# Altium schematic sheet CONNECTION.SchDoc
size A4; SheetNumber: 6; SheetTotal: 6
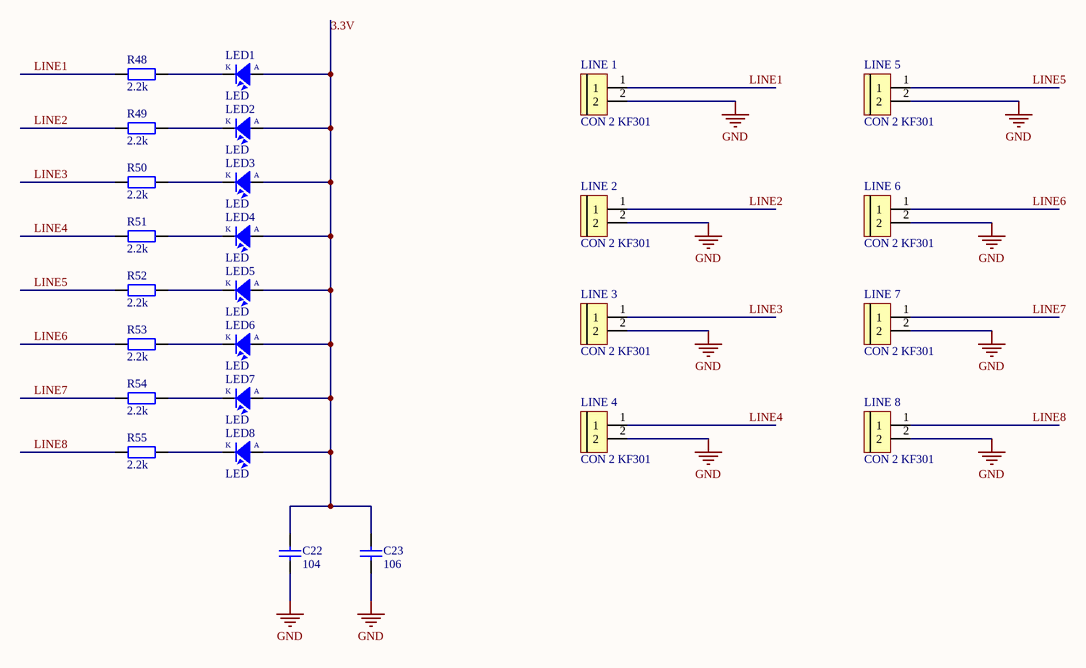
[diagram p0: CONNECTION.SchDoc]

## Parts
C22  104  [tu 0603]
C23  106  [tu 0603]
LED1  LED  [LED-0805]
LED2  LED  [LED-0805]
LED3  LED  [LED-0805]
LED4  LED  [LED-0805]
LED5  LED  [LED-0805]
LED6  LED  [LED-0805]
LED7  LED  [LED-0805]
LED8  LED  [LED-0805]
LINE_1  CON 2 KF301  [Con 2 KF301 5.08]
LINE_2  CON 2 KF301  [Con 2 KF301 5.08]
LINE_3  CON 2 KF301  [Con 2 KF301 5.08]
LINE_4  CON 2 KF301  [Con 2 KF301 5.08]
LINE_5  CON 2 KF301  [Con 2 KF301 5.08]
LINE_6  CON 2 KF301  [Con 2 KF301 5.08]
LINE_7  CON 2 KF301  [Con 2 KF301 5.08]
LINE_8  CON 2 KF301  [Con 2 KF301 5.08]
R48  2.2k  [tro smd 0805]
R49  2.2k  [tro smd 0805]
R50  2.2k  [tro smd 0805]
R51  2.2k  [tro smd 0805]
R52  2.2k  [tro smd 0805]
R53  2.2k  [tro smd 0805]
R54  2.2k  [tro smd 0805]
R55  2.2k  [tro smd 0805]

## Nets
GND: C22.2 C23.2 LINE_1.2 LINE_2.2 LINE_3.2 LINE_4.2 LINE_5.2 LINE_6.2 LINE_7.2 LINE_8.2
3.3V: C22.1 C23.1 LED1.1(A) LED2.1(A) LED3.1(A) LED4.1(A) LED5.1(A) LED6.1(A) LED7.1(A) LED8.1(A)
LINE1: LINE_1.1 R48.2
LINE2: LINE_2.1 R49.2
LINE3: LINE_3.1 R50.2
LINE4: LINE_4.1 R51.2
LINE5: LINE_5.1 R52.2
LINE6: LINE_6.1 R53.2
LINE7: LINE_7.1 R54.2
LINE8: LINE_8.1 R55.2
NetLED1_2: LED1.2(K) R48.1
NetLED2_2: LED2.2(K) R49.1
NetLED3_2: LED3.2(K) R50.1
NetLED4_2: LED4.2(K) R51.1
NetLED5_2: LED5.2(K) R52.1
NetLED6_2: LED6.2(K) R53.1
NetLED7_2: LED7.2(K) R54.1
NetLED8_2: LED8.2(K) R55.1

## Library data of the parts
C22 = Tu 0603 104 50V 10%: Dán; Don_Vi: Con; So_Chan: 2; Ten_Linh_Kien: Tụ 0603 104-100nF 10% 50V; Ma_Hang: MH004568; Chung_Loai: Dán; Kieu_Chan: *
C23 = Tu 0603 106 16V 20%: Dán; Don_Vi: Con; So_Chan: 2; Ten_Linh_Kien: Tụ 0603-10uF 20% 16V; Ma_Hang: MH004848; Chung_Loai: Dán; Kieu_Chan: *
LED1-LED8 = LED: LED Single colour Green and Red; Value: LED 3 ly Single Colour
LINE_1-LINE_8 = CON 2 KF301: Cắm; Ma_Hang: MH000987; Ten_Linh_Kien: CON 2 KF301-2P 5.08MM Xanh Dương; Chung_Loai: Cắm; Ghi_Chu: *; Kieu_Chan: *; Don_Vi: Con
R48-R55 = Tro 0805 1% 2k: Dán; Don_Vi: Con; So_Chan: 2; Ten_Linh_Kien: Trở 0805 1% 2k; Ma_Hang: MH005471; Chung_Loai: Dán; Kieu_Chan: *